# Altium schematic sheet 51_board.SchDoc
size A4
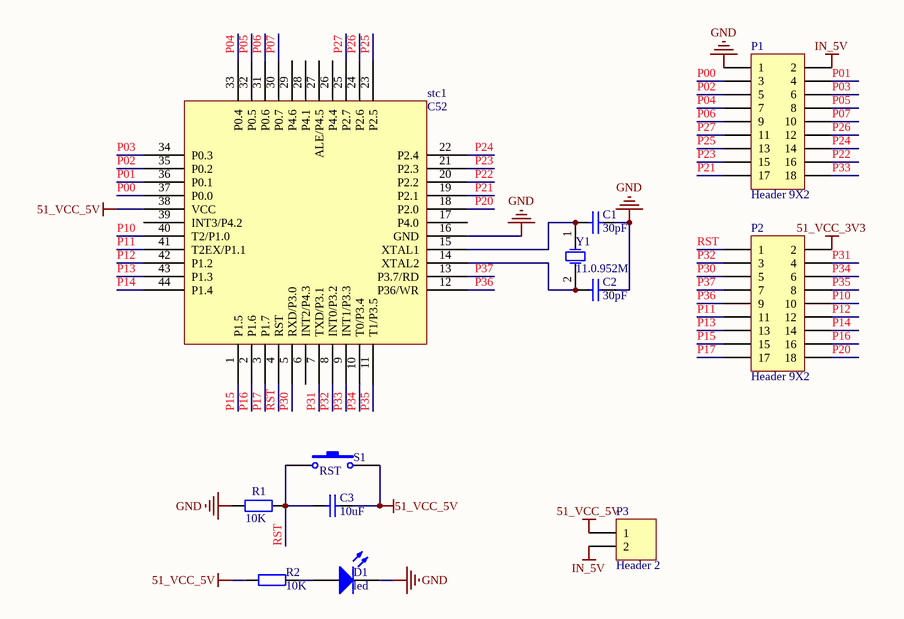
[diagram p0: 51_board.SchDoc]

## Parts
C1  value 30pF  [6-0805_N]
C2  value 30pF  [6-0805_N]
C3  value 10uF  [6-0805_N]
D1  led  [LED]
P1  Header 9X2  [XDR2x9_S]
P2  Header 9X2  [XDR2x9_S]
P3  Header 2  [HDR1X2]
R1  value 10K  [6-0805_N]
R2  value 10K  [6-0805_N]
S1  RST  [SPST-2]
stc1  C52  [LQFP44]
Y1  11.0.952M  [HC-49S]

## Nets
51_VCC_3V3: P2.2
51_VCC_5V: C3.2 P3.1 R2.1 S1.2 stc1.38(VCC)
GND: C1.1 C2.1 D1.2(K) P1.1 R1.1 stc1.16(GND)
IN_5V: P1.2 P3.2
P00: P1.3 stc1.37(P0.0)
P01: P1.4 stc1.36(P0.1)
P02: P1.5 stc1.35(P0.2)
P03: P1.6 stc1.34(P0.3)
P04: P1.7 stc1.33(P0.4)
P05: P1.8 stc1.32(P0.5)
P06: P1.9 stc1.31(P0.6)
P07: P1.10 stc1.30(P0.7)
P10: P2.10 stc1.40(T2/P1.0)
P11: P2.11 stc1.41(T2EX/P1.1)
P12: P2.12 stc1.42(P1.2)
P13: P2.13 stc1.43(P1.3)
P14: P2.14 stc1.44(P1.4)
P15: P2.15 stc1.1(P1.5)
P16: P2.16 stc1.2(P1.6)
P17: P2.17 stc1.3(P1.7)
P20: P2.18 stc1.18(P2.0)
P21: P1.17 stc1.19(P2.1)
P22: P1.16 stc1.20(P2.2)
P23: P1.15 stc1.21(P2.3)
P24: P1.14 stc1.22(P2.4)
P25: P1.13 stc1.23(P2.5)
P26: P1.12 stc1.24(P2.6)
P27: P1.11 stc1.25(P2.7)
P30: P2.5 stc1.5(RXD/P3.0)
P31: P2.4 stc1.7(TXD/P3.1)
P32: P2.3 stc1.8(INT0/P3.2)
P33: P1.18 stc1.9(INT1/P3.3)
P34: P2.6 stc1.10(T0/P3.4)
P35: P2.8 stc1.11(T1/P3.5)
P36: P2.9 stc1.12(P36/WR)
P37: P2.7 stc1.13(P3.7/RD)
RST: C3.1 P2.1 R1.2 S1.1 stc1.4(RST)
NetC1_2: C1.2 stc1.15(XTAL1) Y1.1(OSC1)
NetC2_2: C2.2 stc1.14(XTAL2) Y1.2(OSC2)
NetD1_1: D1.1(A) R2.2

Not connected (* = marked no-connect by the designer): stc1 6(INT2/P4.3) 17(P4.0) 26(P4.4) 27(ALE/P4.5) 28(P4.1) 29(P4.6) 39(INT3/P4.2)

## Library data of the parts
C1-C3 = Cap: Capacitor; Published: 8-Jun-2000; LatestRevisionDate: 17-Jul-2002; LatestRevisionNote: Re-released for DXP Platform.; PackageReference: RAD-0.3; Publisher: Altium Limited; PackageDescription: Radial Cap, Thru-Hole; 2 Leads; 0.3 in Pin Spacing
D1 = LED0: Typical INFRARED GaAs LED; Published: 8-Jun-2000; LatestRevisionDate: 08-Jul-2005; LatestRevisionNote: Mech Layer 1 removed.; PackageReference: LED-0; Publisher: Altium Limited; PackageDescription: LED; 2 Leads
P1 P2 = Header 9X2: Header, 9-Pin, Dual row; LatestRevisionDate: 17-Jul-2002; LatestRevisionNote: Re-released for DXP Platform.; Publisher: Altium Limited
P3 = Header 2: Header, 2-Pin; LatestRevisionDate: 17-Jul-2002; LatestRevisionNote: Re-released for DXP Platform.; Publisher: Altium Limited
R1 R2 = Res2: Resistor; Published: 8-Jun-2000; LatestRevisionDate: 17-Jul-2002; LatestRevisionNote: Re-released for DXP Platform.; PackageReference: AXIAL-0.4; Publisher: Altium Limited; PackageDescription: Axial Device, Thru-Hole; 2 Leads; 0.4 in Pin Spacing
S1 = SW-PB: Switch; Published: 24-Mar-1999; LatestRevisionDate: 17-Jul-2002; LatestRevisionNote: Re-released for DXP Platform.; PackageReference: SPST-2; Publisher: Altium Limited; PackageDescription: Switch; 2 Leads
Y1 = XTAL: Crystal Oscillator; Published: 8-Jun-2000; LatestRevisionDate: 17-Jul-2002; LatestRevisionNote: Re-released for DXP Platform.; PackageReference: R38; Publisher: Altium Limited; PackageDescription: Crystal, Thru-Hole; 2 Leads; Body 3.1 x 8.2 mm (Dia.xH)